# Altium schematic sheet TOP.SchDoc: Title
size A4; Date: *******; ApprovedBy: *******; CheckedBy: None; Author: *******; CompanyName: *******; DrawnBy: Jacob Chisholm; Engineer: *******; Organization: *******; Address1: *******; Address2: *******; Address3: *******; Address4: *******; DocumentNumber: 1; Revision: *******; SheetNumber: 1; SheetTotal: 9; Address_Website: https://jchisholm204.github.io; E-Mail: JacobChisholm1010@gmail.com; CurrentTime: *******; CurrentDate: *******; Time: *******; DocumentFullPathAndName: *******; DocumentName: *******; ModifiedDate: *******; ImagePath: *******; ProjectName: *******; Application_BuildNumber: *******
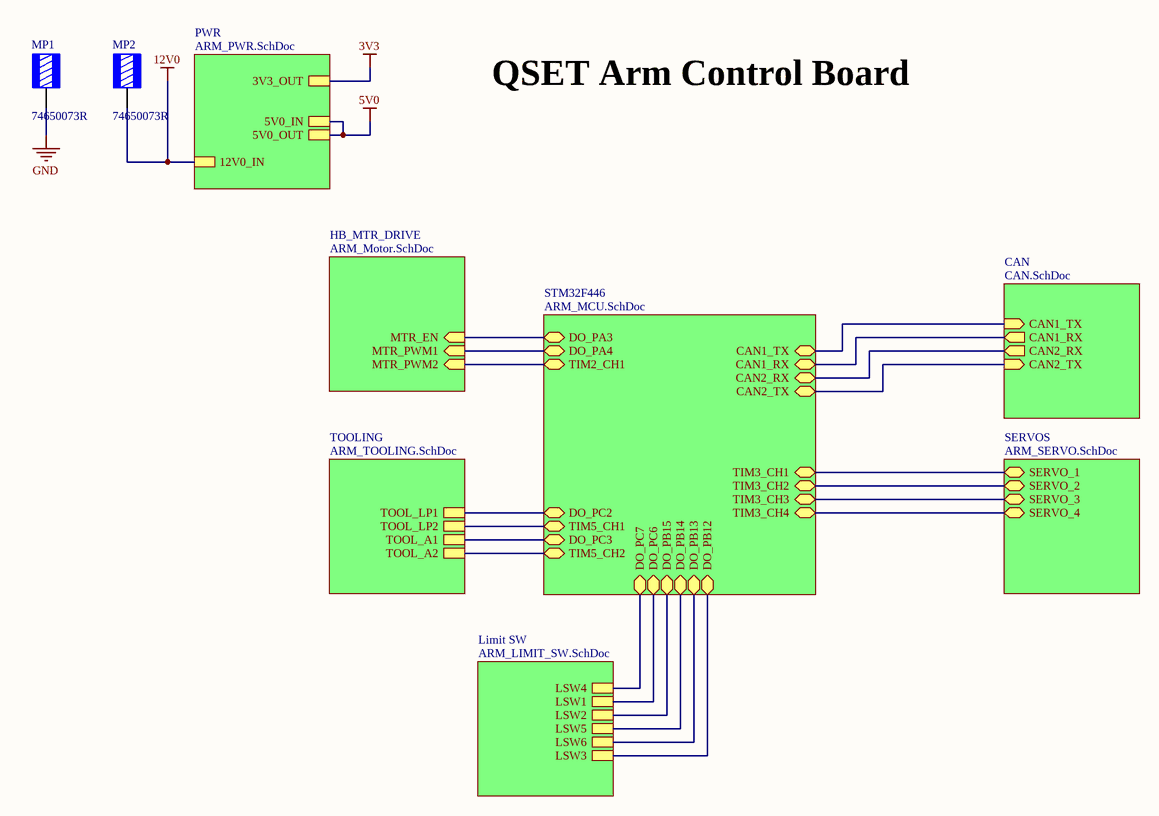
[diagram p0: TOP.SchDoc]

## Parts
MP1  74650073R  [WURTH 74650073]
MP2  74650073R  [WURTH 74650073]

## Sub-sheets
CAN = CAN.SchDoc: CAN1_TX (in), CAN1_RX (out), CAN2_TX (in), CAN2_RX (out)
HB_MTR_DRIVE = ARM_Motor.SchDoc: MTR_EN (in), MTR_PWM1 (in), MTR_PWM2 (in)
Limit SW = ARM_LIMIT_SW.SchDoc: LSW1, LSW3, LSW5, LSW2, LSW4, LSW6
PWR = ARM_PWR.SchDoc: 3V3_OUT, 5V0_IN, 12V0_IN, 5V0_OUT
SERVOS = ARM_SERVO.SchDoc: SERVO_1 (bidir), SERVO_2 (bidir), SERVO_3 (bidir), SERVO_4 (bidir)
STM32F446 = ARM_MCU.SchDoc: TIM5_CH1 (bidir), TIM5_CH2 (bidir), DO_PA3 (bidir), DO_PA4 (bidir), DO_PC6 (bidir), DO_PC7 (bidir), DO_PB15 (bidir), DO_PB14 (bidir), TIM3_CH3 (bidir), TIM3_CH4 (bidir), CAN1_RX (bidir), CAN1_TX (bidir), DO_PB13 (bidir), TIM3_CH2 (bidir), DO_PB12 (bidir), CAN2_RX (bidir), CAN2_TX (bidir), TIM3_CH1 (bidir), TIM2_CH1 (bidir), DO_PC2 (bidir), DO_PC3 (bidir)
TOOLING = ARM_TOOLING.SchDoc: TOOL_LP1, TOOL_LP2, TOOL_A1, TOOL_A2

## Nets
3V3: sheet PWR/3V3_OUT
5V0: sheet PWR/5V0_IN, sheet PWR/5V0_OUT
12V0: MP2.1 ; sheet PWR/12V0_IN
GND: MP1.1
(unnamed): sheet STM32F446/TIM5_CH1, sheet TOOLING/TOOL_LP2
(unnamed): sheet STM32F446/TIM5_CH2, sheet TOOLING/TOOL_A2
(unnamed): sheet STM32F446/DO_PA3, sheet HB_MTR_DRIVE/MTR_EN
(unnamed): sheet STM32F446/DO_PA4, sheet HB_MTR_DRIVE/MTR_PWM1
(unnamed): sheet STM32F446/DO_PC6, sheet Limit SW/LSW1
(unnamed): sheet STM32F446/DO_PC7, sheet Limit SW/LSW4
(unnamed): sheet STM32F446/DO_PB15, sheet Limit SW/LSW2
(unnamed): sheet STM32F446/DO_PB14, sheet Limit SW/LSW5
(unnamed): sheet STM32F446/TIM3_CH3, sheet SERVOS/SERVO_3
(unnamed): sheet STM32F446/TIM3_CH4, sheet SERVOS/SERVO_4
(unnamed): sheet STM32F446/CAN1_RX, sheet CAN/CAN1_RX
(unnamed): sheet STM32F446/CAN1_TX, sheet CAN/CAN1_TX
(unnamed): sheet STM32F446/DO_PB13, sheet Limit SW/LSW6
(unnamed): sheet STM32F446/TIM3_CH2, sheet SERVOS/SERVO_2
(unnamed): sheet STM32F446/DO_PB12, sheet Limit SW/LSW3
(unnamed): sheet STM32F446/CAN2_RX, sheet CAN/CAN2_RX
(unnamed): sheet STM32F446/CAN2_TX, sheet CAN/CAN2_TX
(unnamed): sheet STM32F446/TIM3_CH1, sheet SERVOS/SERVO_1
(unnamed): sheet STM32F446/TIM2_CH1, sheet HB_MTR_DRIVE/MTR_PWM2
(unnamed): sheet STM32F446/DO_PC2, sheet TOOLING/TOOL_LP1
(unnamed): sheet STM32F446/DO_PC3, sheet TOOLING/TOOL_A1

## Notes on the sheet
- QSET Arm Control Board
- Title:
- Drawn By:
- Page Contents:
- Checked By:
- Size:
- Date:
- File:
- License:
- Email:
- A4
- Number:
- Time:
- Revision:
- Sheet
- Website:
- of

## Library data of the parts
MP1 MP2 = 74650073R: TERM REDCUBE M3 4PIN PCB; Manufacturer: Würth Elektronik; Current Rating (Amps): 50 A; Part Number: 74650073R; ComponentLink1Description: Datasheet; ComponentLink1URL: https://katalog.we-online.de/em/datasheet/74650073R.pdf; ComponentLink2Description: DigiKey Link; ComponentLink2URL: https://www.digikey.com/en/products/detail/würth-elektronik/74650073R/6643978; Features: Screw not Included; LastUpdated: 8/7/2022 8:38:54 PM; Lifecycle Status: Active; Minimum Order: 1; Mounting Type: Through Hole; Number of Pins: 4; Packaging: TapeAndReel; Part Status: Active; Price: 2.28; Screw Size: M3; Series: REDCUBE WP-THRBU; Supplier 1: DigiKey; Supplier Part Number 1: 732-10882-1-ND; Terminal Type: Screw Terminal, Power Tap; Termination: Solder